# EAGLE schematic qPCR_pcb_breakout_ADS1219IPWR (EAGLE 9.6.1)
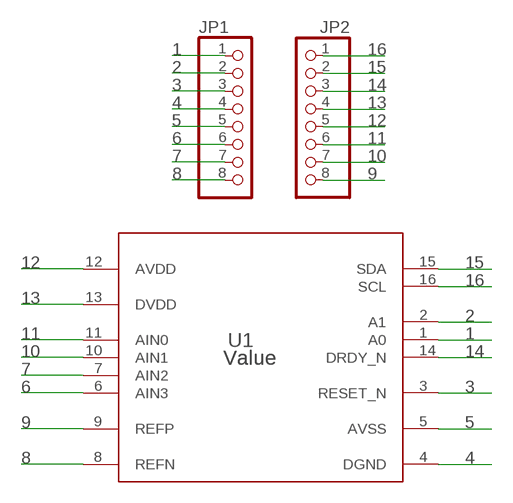
[diagram p0: schematic, sheet 1]

## Parts
JP1  PINHD-1X8  [1X08]
JP2  PINHD-1X8  [1X08]
U1  Value  ADS1219IPW  [PW0016A_N]

## Nets
1: JP1.1 U1.1(A0)
2: JP1.2 U1.2(A1)
3: JP1.3 U1.3(RESET_N)
4: JP1.4 U1.4(DGND)
5: JP1.5 U1.5(AVSS)
6: JP1.6 U1.6(AIN3)
7: JP1.7 U1.7(AIN2)
8: JP1.8 U1.8(REFN)
9: JP2.8 U1.9(REFP)
10: JP2.7 U1.10(AIN1)
11: JP2.6 U1.11(AIN0)
12: JP2.5 U1.12(AVDD)
13: JP2.4 U1.13(DVDD)
14: JP2.3 U1.14(DRDY_N)
15: JP2.2 U1.15(SDA)
16: JP2.1 U1.16(SCL)

## Library data of the parts
JP1 JP2 = pinhead:PINHD-1X8: PIN HEADER
U1 = Ninja_qPCR:ADS1219IPW; MANUFACTURER: Texas Instruments; PARTNUMBER: ADS1219IPWR; REFDES: RefDes; TYPE: TYPE